# EAGLE design Joint Controller Circuit (EAGLE 7.2.0)

## Sheet 1 of 2
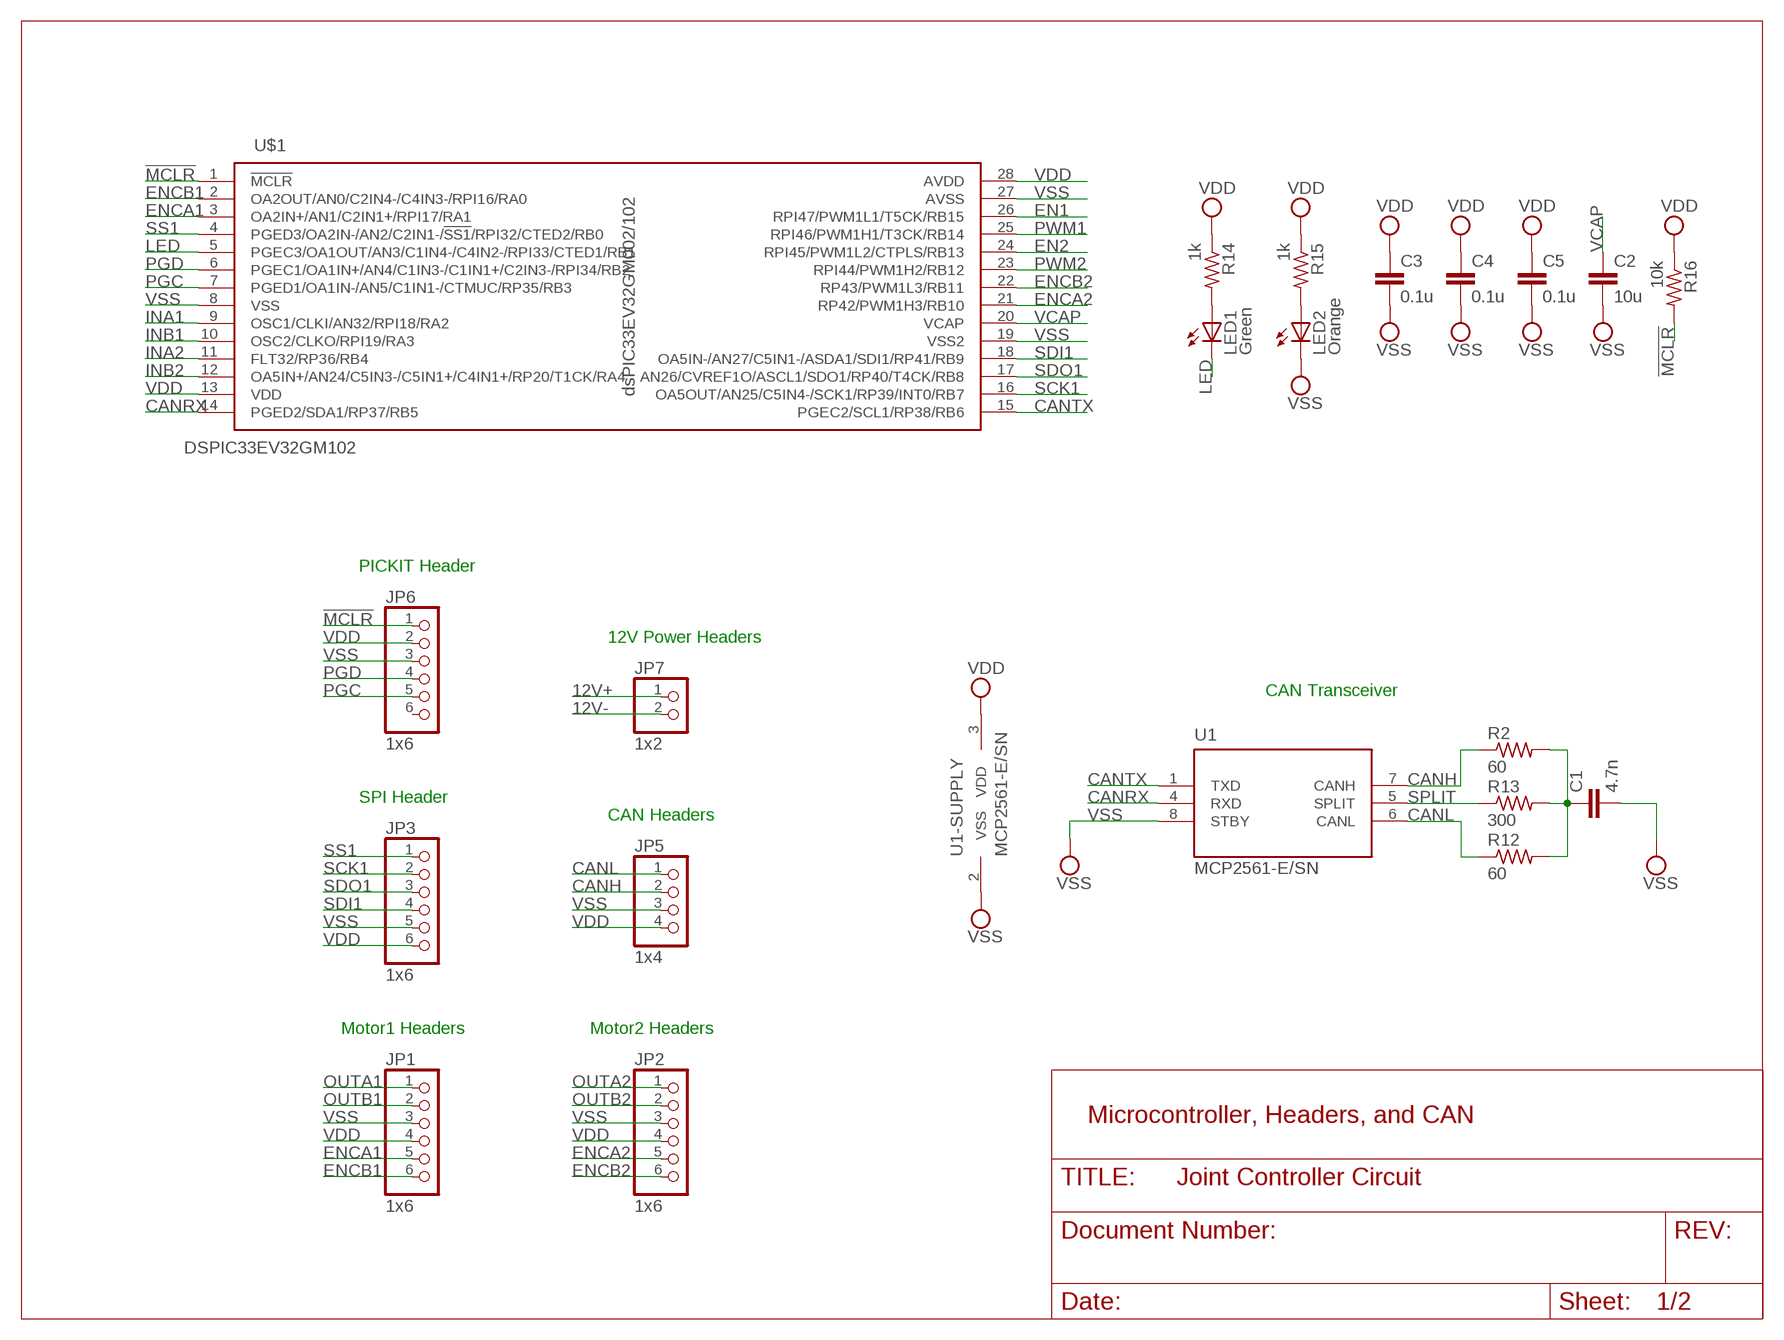
[diagram p0: schematic, sheet 1]

### Parts
C1  4.7n  C-EUC0805  [C0805]
C2  10u  C-EUC0805  [C0805]
C3  0.1u  C-EUC0805  [C0805]
C4  0.1u  C-EUC0805  [C0805]
C5  0.1u  C-EUC0805  [C0805]
JP1  1x6  PINHD-1X6  [1X06]
JP2  1x6  PINHD-1X6  [1X06]
JP3  1x6  PINHD-1X6  [1X06]
JP5  1x4  PINHD-1X4  [1X04]
JP6  1x6  PINHD-1X6  [1X06]
JP7  1x2  PINHD-1X2  [1X02]
LED1  Green  LEDCHIP-LED0805  [CHIP-LED0805]
LED2  Orange  LEDCHIP-LED0805  [CHIP-LED0805]
R2  60  R-US_R0805  [R0805]
R12  60  R-US_R0805  [R0805]
R13  300  R-US_R0805  [R0805]
R14  1k  R-US_R0805  [R0805]
R15  1k  R-US_R0805  [R0805]
R16  10k  R-US_R0805  [R0805]
U1  MCP2561-E/SN  [SOIC-8]
U$1  DSPIC33EV32GM102  [SOIC28]

### Nets
12V+: JP7.1 ; also sheet 2
12V-: JP7.2 ; also sheet 2
!MCLR: JP6.1 R16.2 U$1.1(!MCLR)
CANH: JP5.2 R2.1 U1.7(CANH)
CANL: JP5.1 R12.1 U1.6(CANL)
CANRX: U1.4(RXD) U$1.14(PGED2/SDA1/RP37/RB5)
CANTX: U1.1(TXD) U$1.15(PGEC2/SCL1/RP38/RB6)
EN1: U$1.26(RPI47/PWM1L1/T5CK/RB15) ; also sheet 2
EN2: U$1.24(RPI45/PWM1L2/CTPLS/RB13) ; also sheet 2
ENCA1: JP1.5 U$1.3(OA2IN+/AN1/C2IN1+/RPI17/RA1)
ENCA2: JP2.5 U$1.21(RP42/PWM1H3/RB10)
ENCB1: JP1.6 U$1.2(OA2OUT/AN0/C2IN4-/C4IN3-/RPI16/RA0)
ENCB2: JP2.6 U$1.22(RP43/PWM1L3/RB11)
INA1: U$1.9(OSC1/CLKI/AN32/RPI18/RA2) ; also sheet 2
INA2: U$1.11(FLT32/RP36/RB4) ; also sheet 2
INB1: U$1.10(OSC2/CLKO/RPI19/RA3) ; also sheet 2
INB2: U$1.12(OA5IN+/AN24/C5IN3-/C5IN1+/C4IN1+/RP20/T1CK/RA4) ; also sheet 2
LED: LED1.C U$1.5(PGEC3/OA1OUT/AN3/C1IN4-/C4IN2-/RPI33/CTED1/RB1)
N$3: C1.1 R2.2 R12.2 R13.2
N$4: LED1.A R14.2
N$6: LED2.A R15.2
OUTA1: JP1.1 ; also sheet 2
OUTA2: JP2.1 ; also sheet 2
OUTB1: JP1.2 ; also sheet 2
OUTB2: JP2.2 ; also sheet 2
PGC: JP6.5 U$1.7(PGED1/OA1IN-/AN5/C1IN1-/CTMUC/RP35/RB3)
PGD: JP6.4 U$1.6(PGEC1/OA1IN+/AN4/C1IN3-/C1IN1+/C2IN3-/RPI34/RB2)
PWM1: U$1.25(RPI46/PWM1H1/T3CK/RB14) ; also sheet 2
PWM2: U$1.23(RPI44/PWM1H2/RB12) ; also sheet 2
SCK1: JP3.2 U$1.16(OA5OUT/AN25/C5IN4-/SCK1/RP39/INT0/RB7)
SDI1: JP3.4 U$1.18(OA5IN-/AN27/C5IN1-/ASDA1/SDI1/RP41/RB9)
SDO1: JP3.3 U$1.17(AN26/CVREF1O/ASCL1/SDO1/RP40/T4CK/RB8)
SPLIT: R13.1 U1.5(SPLIT)
SS1: JP3.1 U$1.4(PGED3/OA2IN-/AN2/C2IN1-/!SS1!/RPI32/CTED2/RB0)
VCAP: C2.1 U$1.20(VCAP)
VDD: C3.1 C4.1 C5.1 JP1.4 JP2.4 JP3.6 JP5.4 JP6.2 R14.1 R15.1 R16.1 U1.3(VDD) U$1.13(VDD) U$1.28(AVDD) ; also sheet 2
VSS: C1.2 C2.2 C3.2 C4.2 C5.2 JP1.3 JP2.3 JP3.5 JP5.3 JP6.3 LED2.C U1.2(VSS) U1.8(STBY) U$1.8(VSS) U$1.19(VSS2) U$1.27(AVSS) ; also sheet 2
Unconnected: JP6.6

### Notes on the sheet
- PICKIT Header
- 12V Power Headers
- CAN Transceiver
- SPI Header
- CAN Headers
- Motor1 Headers | Motor2 Headers
- Microcontroller, Headers, and CAN

## Sheet 2 of 2
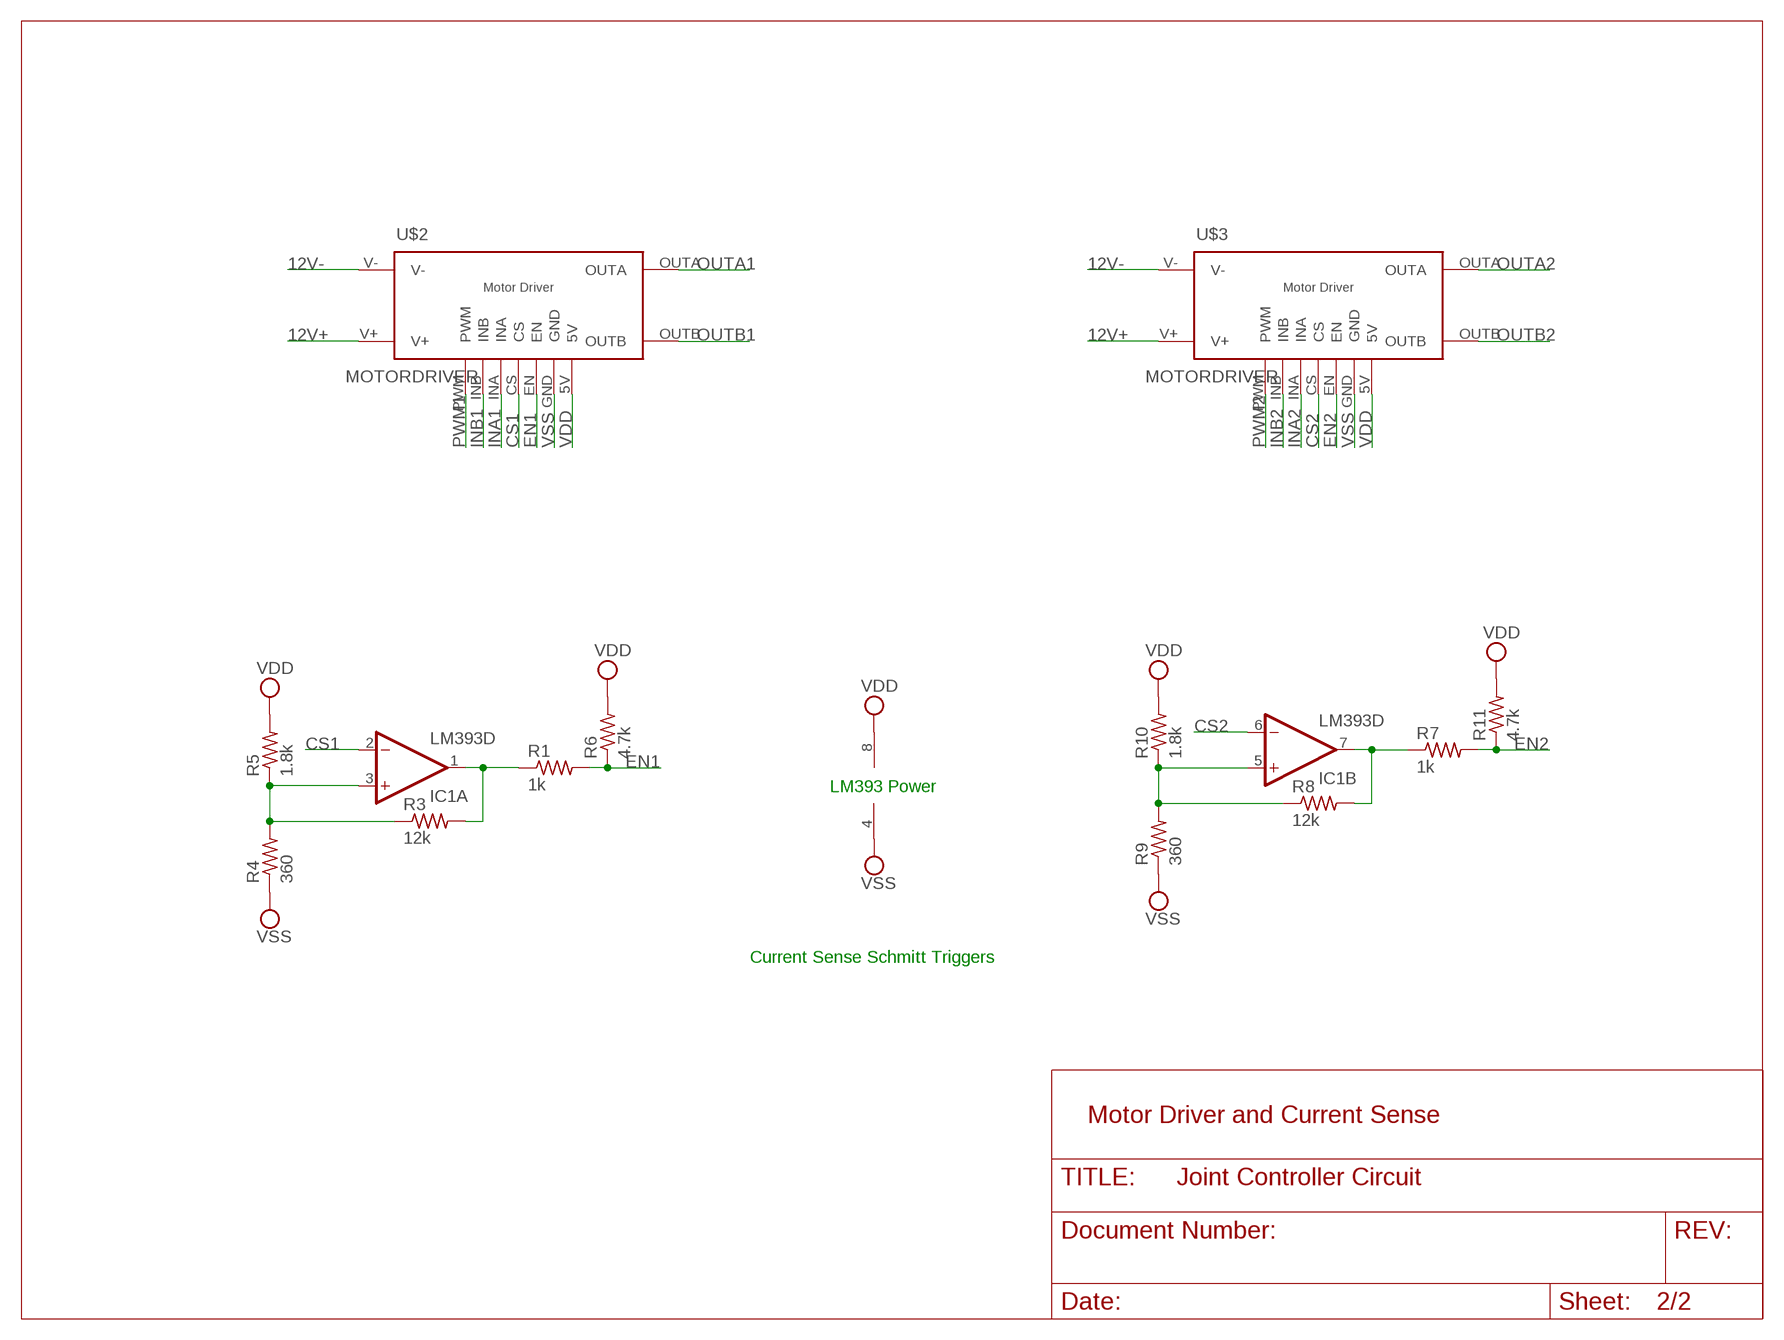
[diagram p1: schematic, sheet 2]

### Parts
IC1  LM393D  [SO08]
R1  1k  R-US_R0805  [R0805]
R3  12k  R-US_R0805  [R0805]
R4  360  R-US_R0805  [R0805]
R5  1.8k  R-US_R0805  [R0805]
R6  4.7k  R-US_R0805  [R0805]
R7  1k  R-US_R0805  [R0805]
R8  12k  R-US_R0805  [R0805]
R9  360  R-US_R0805  [R0805]
R10  1.8k  R-US_R0805  [R0805]
R11  4.7k  R-US_R0805  [R0805]
U$2  MOTORDRIVER  [MOTORDRIVER]
U$3  MOTORDRIVER  [MOTORDRIVER]

### Nets
12V+: U$2.V+ U$3.V+ ; also sheet 1
12V-: U$2.V- U$3.V- ; also sheet 1
CS1: IC1.2(A:-IN) U$2.CS
CS2: IC1.6(B:-IN) U$3.CS
EN1: R1.2 R6.1 U$2.EN ; also sheet 1
EN2: R7.2 R11.1 U$3.EN ; also sheet 1
INA1: U$2.INA ; also sheet 1
INA2: U$3.INA ; also sheet 1
INB1: U$2.INB ; also sheet 1
INB2: U$3.INB ; also sheet 1
N$2: IC1.7(B:OUT) R7.1 R8.2
N$25: IC1.5(B:+IN) R8.1 R9.2 R10.1
N$28: IC1.3(A:+IN) R3.1 R4.2 R5.1
N$30: IC1.1(A:OUT) R1.1 R3.2
OUTA1: U$2.OUTA ; also sheet 1
OUTA2: U$3.OUTA ; also sheet 1
OUTB1: U$2.OUTB ; also sheet 1
OUTB2: U$3.OUTB ; also sheet 1
PWM1: U$2.PWM ; also sheet 1
PWM2: U$3.PWM ; also sheet 1
VDD: IC1.8(P:V+) R5.2 R6.2 R10.2 R11.2 U$2.5V U$3.5V ; also sheet 1
VSS: IC1.4(P:V-) R4.1 R9.1 U$2.GND U$3.GND ; also sheet 1

### Notes on the sheet
- LM393 Power
- Current Sense Schmitt Triggers
- Motor Driver and Current Sense

## Library data of the parts
C1-C5 = rcl:C-EU: CAPACITOR, European symbol
IC1 = linear:LM393: COMPARATOR
JP1-JP3 JP6 = pinhead:PINHD-1X6: PIN HEADER
JP5 = pinhead:PINHD-1X4: PIN HEADER
JP7 = pinhead:PINHD-1X2: PIN HEADER
LED1 LED2 = led:LED: LED OSRAM: - CHIPLED LG R971, LG N971, LY N971, LG Q971, LY Q971, LO R971, LY R971 LH N974, LH R974 LS Q976, LO Q976, LY Q976 LO Q996 - Hyper CHIPLED LW Q18S LB Q993, LB Q99A, LB R99A - SideLED LS A670, LO A670, LY A670, LG A670, LP A670 LB A673, LV A673, LT A673, LW A673 LH A674 LY A675 LS A676, LA A676, LO A676, LY A676, LW A676 LS A679, LY A679, LG A679 - Hyper Micro SIDELED® LS Y876, LA Y876, LO Y876, LY Y876 LT Y87S - SmartLED LW L88C, LW L88S LB L89C, LB L89S, LG L890 LS L89K, LO L89K, LY L89K LS L896, LA L896, LO L896, LY L896 - TOPLED LS T670, LO T670, LY T670, LG T670, LP T670 LSG T670, LSP T670, LSY T670, LOP T670, LYG T670 LG T671, LOG T671, LSG T671 LB T673, LV T673, LT T673, LW T673 LH T674 LS T676, LA T676, LO T676, LY T676, LB T676, LH T676, LSB T676, LW T676 LB T67C, LV T67C, LT T67C, LS T67K, LO T67K, LY T67K, LW E67C LS E67B, LA E67B, LO E67B, LY E67B, LB E67C, LV E67C, LT E67C LW T67C LS T679, LY T679, LG T679 LS T770, LO T770, LY T770, LG T770, LP T770 LB T773, LV T773, LT T773, LW T773 LH T774 LS E675, LA E675, LY E675, LS T675 LS T776, LA T776, LO T776, LY T776, LB T776 LHGB T686 LT T68C, LB T68C - Hyper Mini TOPLED® LB M676 - Mini TOPLED Santana® LG M470 LS M47K, LO M47K, LY M47K Source: http://www.osram.convergy.de LUXEON: - LUMILED® LXK2-PW12-R00, LXK2-PW12-S00, LXK2-PW14-U00, LXK2-PW14-V00 LXK2-PM12-R00, LXK2-PM12-S00, LXK2-PM14-U00 LXK2-PE12-Q00, LXK2-PE12-R00, LXK2-PE12-S00, LXK2-PE14-T00, LXK2-PE14-U00 LXK2-PB12-K00, LXK2-PB12-L00, LXK2-PB12-M00, LXK2-PB14-N00, LXK2-PB14-P00, LXK2-PB14-Q00 LXK2-PR12-L00, LXK2-PR12-M00, LXK2-PR14-Q00, LXK2-PR14-R00 LXK2-PD12-Q00, LXK2-PD12-R00, LXK2-PD12-S00 LXK2-PH12-R00, LXK2-PH12-S00 LXK2-PL12-P00, LXK2-PL12-Q00, LXK2-PL12-R00 Source: www.luxeon.com KINGBRIGHT: KA-3528ASYC Source: www.kingbright.com
R1-R16 = rcl:R-US_: RESISTOR, American symbol
U1 = Volks73-MicrochipTechnology:MCP2561-*/?: High-Speed CAN Transceiver Documentation Datasheet <http://ww1.microchip.com/downloads/en/DeviceDoc/20005167C.pdf> General Description The MCP2561/2 is a Microchip Technology Inc. second generation high-speed CAN transceiver. It serves as an interface between a CAN protocol controller and the physical two-wire CAN bus. The device meets the automotive requirements for high-speed (up to 1 Mb/s), low quiescent current, electromagnetic compatibility (EMC) and electrostatis discharge (ESD). Features Supports 1 Mb/s Operation Implements ISO-11898-2 and ISO-11898-5 Standard Physical Layer Requirements Very Low Standby Current (5 µA, typical) VIO Supply Pin to Interface Directly to CAN Controllers and Microcontrollers with 1.8V to 5.5V I/O SPLIT Output Pin to Stabilize Common Mode in Biased Split Termination Schemes CAN Bus Pins are Disconnected when Device is Unpowered: An Unpowered Node or Brown-Out Event will Not Load the CAN Bus Detection of Ground Fault: Permanent Dominant Detection on TXD Permanent Dominant Detection on Bus Power-on Reset and Voltage Brown-Out Protection on VDD Pin Protection Against Damage Due to Short-Circuit Conditions (Positive or Negative Battery Voltage) Protection Against High-Voltage Transients in Automotive Environments Automatic Thermal Shutdown Protection Suitable for 12V and 24V Systems Meets or exceeds stringent automotive design requirements including “Hardware Requirements for LIN, CAN and FlexRay Interfaces in Automotive Applications”, Version 1.3, May 2012 High-Noise Immunity Due to Differential Bus Implementation High Electrostatic Discharge (ESD) Protection on CANH and CANL, meeting the IEC61000-4-2 up to ±14 kV Available in PDIP-8L, SOIC-8L and 3x3 DFN-8L Temperature ranges: Extended (E): -40°C to +125°C High (H): -40°C to +150°C; CATEGORY: Integrated Circuits (ICs); DATA_RATE: -; DESCRIPTION: IC TXRX CAN 8SOIC; DOCUMENTATION_LINK: <a href="http://ww1.microchip.com/downloads/en/DeviceDoc/20005167C.pdf">Datasheet</a>; DOCUMENTATION_URL: http://ww1.microchip.com/downloads/en/DeviceDoc/20005167C.pdf; DUPLEX: Full; FAMILY: Interface - Drivers, Receivers, Transceivers; MANUFACTURER: Microchip Technology; MOUNTING_TYPE: Surface Mount; NUMBER_OF_DRIVERS-RECEIVERS: 1/1; OPERATING_TEMPERATURE: -40°C ~ 125°C; PACKAGE_CASE: 8-SOIC (0.154", 3.90mm Width); PART_NUMBER: MCP2561-E/SN; PROTOCOL: CAN; RECEIVER_HYSTERSIS: -; SERIES: -; SUPPLIER_DEVICE_PACKAGE: 8-SOIC N; SUPPLIER_ITEM_INFO: http://www.digikey.com/product-detail/en/MCP2561-E%2FSN/MCP2561-E%2FSN-ND/4079961; SUPPLIER_ITEM_LINK: <a href="http://www.digikey.com/product-detail/en/MCP2561-E%2FSN/MCP2561-E%2FSN-ND/4079961">Details</a>; SUPPLIER_ITEM_NUMBER: MCP2561-E/SN-ND; SUPPLIER_ITEM_URL: http://www.digikey.com/product-detail/en/MCP2561-E%2FSN/MCP2561-E%2FSN-ND/4079961; SUPPLIER_LINK: <a href="http://www.digikey.com">Home Page</a>; SUPPLIER_NAME: Digi-Key; SUPPLIER_URL: http://www.digikey.com; TYPE: Transceiver; VOLTAGE-SUPPLY: 4.5 V ~ 5.5 V
U$1 = dsPIC33EV32GM102:DSPIC33EV32GM102
U$2 U$3 = dsPIC33EV32GM102:MOTORDRIVER

## Board
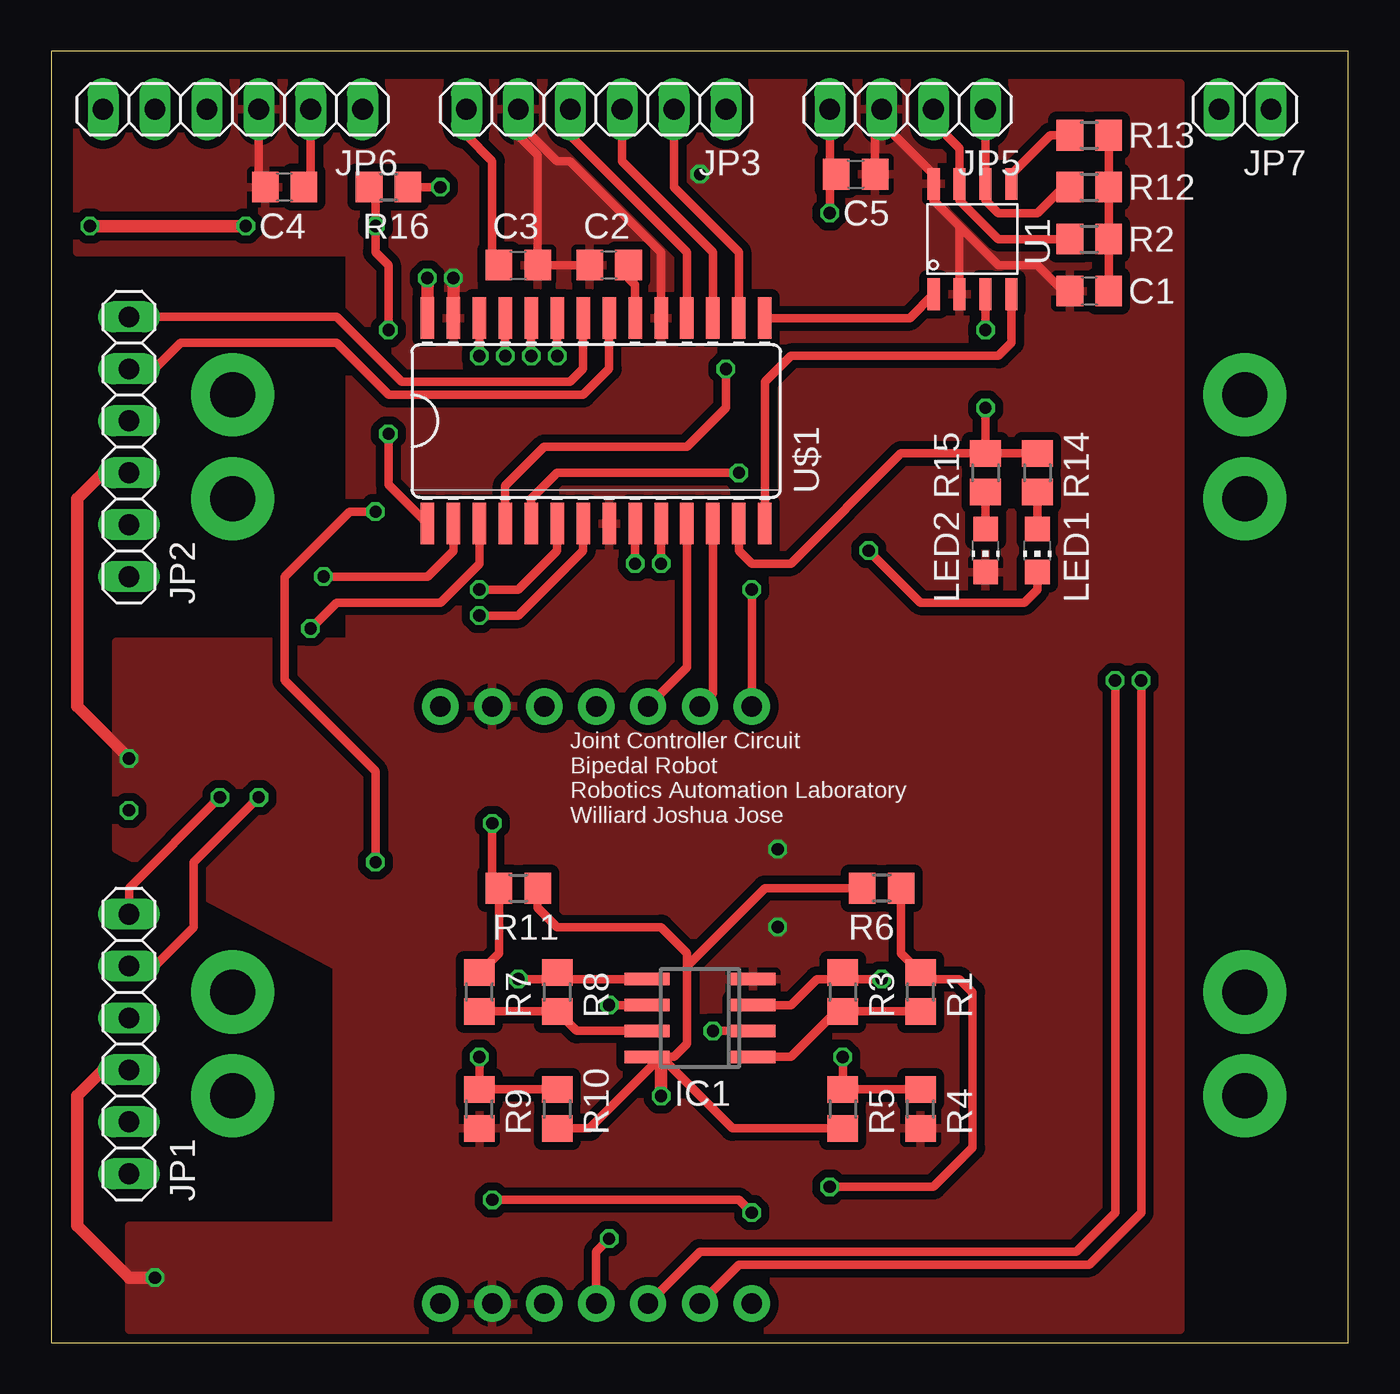
[diagram p2: board, top side]
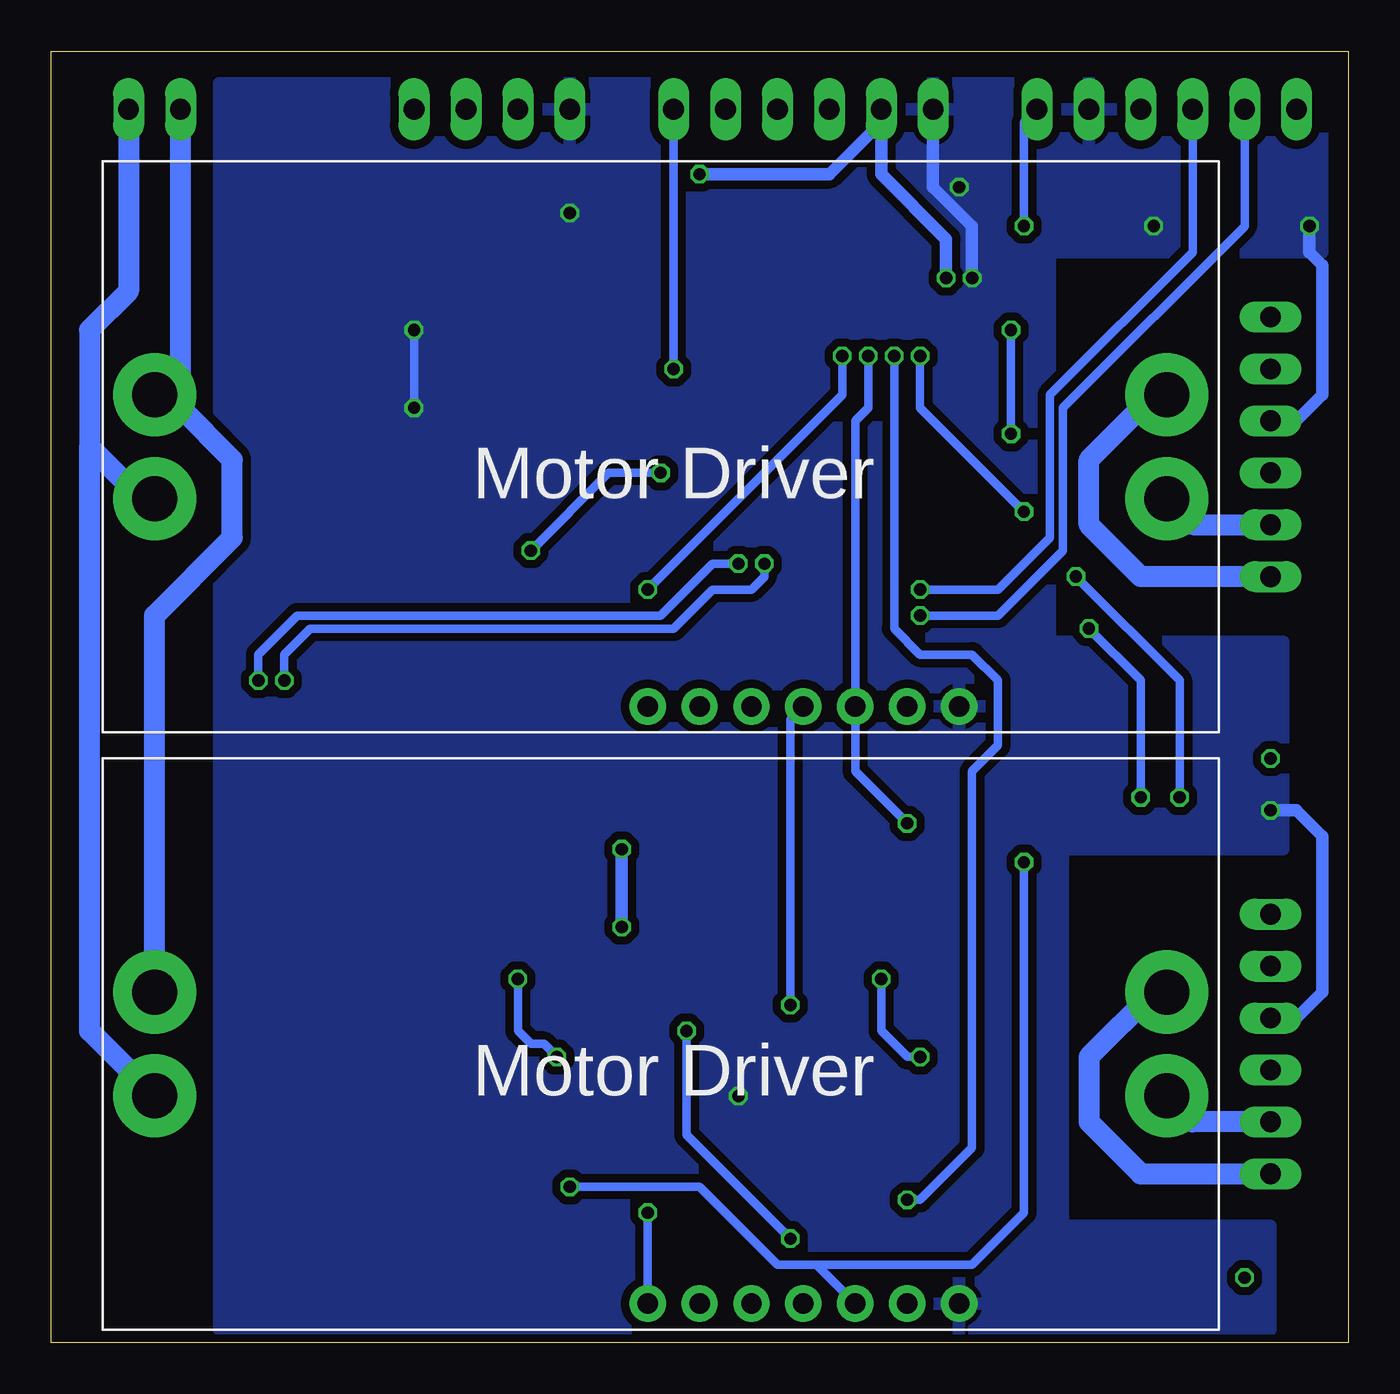
[diagram p3: board, bottom side, seen from below]

Size 63.48 x 63.17 mm. Coordinates in mm from the lower left corner, seen from the top.
Outline: 0,0 63.48,0 63.48,63.17 0,63.17 0,0
Copper layers (1*16): Top 0.035mm / dielectric 1.5mm / Bottom 0.035mm
Design rules "Elecrow_2-layer_eagle_rule": minimum track width 6mil, minimum drill 12mil, track to track 6mil, track to pad 6mil, pad to pad 6mil, via to via 6mil, smd to smd 0mil, copper to edge 10mil, drill to drill 10mil, minimum pad ring 10mil, minimum via ring 6mil, stop-mask expansion 2mil, vias tented up to drill 100mil, thermal gap 10mil

### Footprints (pad centres in the part's own frame; a part is rotated, then mirrored left to right if it is on the bottom)
C0805 = smd 1.3 x 1.5: 1 -0.95,0; 2 0.95,0
SO08 = smd 0.6 x 2.2: 1 -1.905,-2.6; 2 -0.635,-2.6; 3 0.635,-2.6; 4 1.905,-2.6; 5 1.905,2.6; 6 0.635,2.6; 7 -0.635,2.6; 8 -1.905,2.6
1X06 = drill 1.016 long: 1 -6.35,0; 2 -3.81,0; 3 -1.27,0; 4 1.27,0; 5 3.81,0; 6 6.35,0
1X04 = drill 1.016 long: 1 -3.81,0; 2 -1.27,0; 3 1.27,0; 4 3.81,0
1X02 = drill 1.016 long: 1 -1.27,0; 2 1.27,0
CHIP-LED0805 = smd 1.2 x 1.2: A 0,-1.05; C 0,1.05
R0805 = smd 1.3 x 1.5: 1 -0.95,0; 2 0.95,0
SOIC-8 = smd 1.55 x 0.6: 1 -2.7,1.905; 2 -2.7,0.635; 3 -2.7,-0.635; 4 -2.7,-1.905; 5 2.7,-1.905; 6 2.7,-0.635; 7 2.7,0.635; 8 2.7,1.905
SOIC28 = smd 0.66 x 2.032: 1 -6.985,-5.029; 2 -5.715,-5.029; 3 -4.445,-5.029; 4 -3.175,-5.029; 5 -1.905,-5.029; 6 -0.635,-5.029; 7 0.635,-5.029; 8 1.905,-5.029; 9 3.175,-5.029; 10 4.445,-5.029; 11 5.715,-5.029; 12 6.985,-5.029; 13 8.255,-5.029; 14 9.525,-5.029; 15 9.525,5.029; 16 8.255,5.029; 17 6.985,5.029; 18 5.715,5.029; 19 4.445,5.029; 20 3.175,5.029; 21 1.905,5.029; 22 0.635,5.029; 23 -0.635,5.029; 24 -1.905,5.029; 25 -3.175,5.029; 26 -4.445,5.029; 27 -5.715,5.029; 28 -6.985,5.029
MOTORDRIVER = drill 1 pad 1.778: 5V 13.97,-11.43; CS 6.35,-11.43; EN 8.89,-11.43; GND 11.43,-11.43; INA 3.81,-11.43; INB 1.27,-11.43; PWM -1.27,-11.43 | drill 2.2 pad 4.064: OUTA 24.13,3.81; OUTB 24.13,-1.27; V+ -25.4,-1.27; V- -25.4,3.81

### Placement (x,y rotation side)
C1  50.8,51.44 180 top
C2  27.3,52.7 180 top
C3  22.86,52.7 0 top
C4  11.43,56.52 180 top
C5  39.37,57.15 0 top
IC1  31.75,15.88 90 top
JP1  3.81,14.61 90 top
JP2  3.81,43.81 90 top
JP3  26.67,60.33 180 top
JP5  41.91,60.33 180 top
JP6  8.89,60.33 180 top
JP7  58.42,60.33 180 top
LED1  48.26,38.73 180 top
LED2  45.72,38.73 180 top
R1  42.55,17.14 90 top
R2  50.8,53.98 0 top
R3  38.73,17.14 270 top
R4  42.55,11.43 90 top
R5  38.73,11.43 270 top
R6  40.64,22.23 180 top
R7  20.95,17.14 90 top
R8  24.77,17.14 270 top
R9  20.95,11.43 90 top
R10  24.77,11.43 270 top
R11  22.86,22.23 0 top
R12  50.8,56.52 0 top
R13  50.8,59.05 0 top
R14  48.26,42.55 270 top
R15  45.72,42.55 270 top
R16  16.51,56.52 180 top
U1  45.09,53.98 90 top
U$1  25.4,45.09 0 top
U$2  33.02,13.34 0 bottom
U$3  33.02,42.55 0 bottom

### Tracks (layer width: path | path; a pad name or v marks a point on that pad's centre or on a via)
12V+
  Bottom 1.016: JP7.1 59.69,51.44 61.59,49.53 61.59,43.81 | 61.59,43.81 59.05,41.27 U$3.V+ | U$2.V+ 61.59,15.24 61.59,43.81
12V-
  Bottom 1.016: U$3.V- 57.15,47.62 | 57.15,47.62 JP7.2 | U$2.V- 58.42,35.56 54.61,39.37 54.61,43.18 57.15,45.72 57.15,47.62
!MCLR  (via drill 0.6)
  Top 0.406: R16.2 15.88,56.2 v15.88,54.61 15.88,53.34 16.51,52.7 v16.51,49.53 | U$1.1 16.51,41.96 v16.51,44.45
  Bottom 0.406: v16.51,44.45 v16.51,49.53 | JP6.1 15.88,59.69 v15.88,54.61
CANH
  Top 0.406: R2.1 46.35,53.98 44.45,55.88 U1.7 44.45,58.42 43.18,59.69 JP5.2
CANL
  Top 0.406: R12.1 49.53,56.52 48.26,55.24 46.35,55.24 45.72,55.88 U1.6 JP5.1
CANRX
  Top 0.406: 34.92,41.27 U$1.14 34.92,46.99 36.2,48.26 46.35,48.26 46.99,48.9 U1.4
CANTX
  Top 0.406: U$1.15 42.02,50.11 U1.1
CS1  (via drill 0.6)
  Top 0.406: IC1.2 v32.38,15.24 | v27.3,5.08 26.67,4.45 U$2.CS
  Bottom 0.406: v32.38,15.24 32.38,10.16 v27.3,5.08
CS2  (via drill 0.6)
  Top 0.406: IC1.6 v27.3,16.51
  Bottom 0.406: v27.3,16.51 27.3,30.48 U$3.CS
EN1  (via drill 0.6)
  Top 0.406: R6.1 41.59,19.05 R1.2 42.86,17.78 44.45,17.78 45.09,17.14 45.09,9.53 43.18,7.62 v38.1,7.62 | U$1.26 v20.95,48.26 | v15.88,40.64 14.61,40.64 11.43,37.47 11.43,32.38 15.88,27.94 v15.88,23.5
  Bottom 0.406: U$2.EN 26.04,3.81 | 26.04,3.81 27.94,3.81 31.75,7.62 v38.1,7.62 | v20.95,48.26 20.95,45.72 v15.88,40.64 | v15.88,23.5 15.88,6.35 18.41,3.81 22.86,3.81 23.5,3.81 26.04,3.81
EN2  (via drill 0.6)
  Top 0.406: R7.2 21.91,19.05 R11.1 21.59,22.55 v21.59,25.4 | U$1.24 v23.5,48.26
  Bottom 0.406: v21.59,25.4 24.13,27.94 U$3.EN 24.13,45.09 23.5,45.72 v23.5,48.26
ENCA1  (via drill 0.6)
  Top 0.406: JP1.5 5.08,18.41 6.99,20.32 6.99,23.5 v10.16,26.67 | U$1.3 20.95,38.1 19.05,36.2 13.97,36.2 v12.7,34.92
  Bottom 0.406: v10.16,26.67 10.16,32.38 v12.7,34.92
ENCA2
  Top 0.406: U$1.21 27.3,47.62 26.04,46.35 16.51,46.35 13.97,48.9 6.35,48.9 5.08,47.62 JP2.5
ENCB1  (via drill 0.6)
  Top 0.406: JP1.6 3.81,22.23 v8.26,26.67 | U$1.2 19.68,38.73 18.41,37.47 v13.34,37.47
  Bottom 0.406: v13.34,37.47 8.26,32.38 v8.26,26.67
ENCB2
  Top 0.406: U$1.22 26.04,47.62 25.4,46.99 17.14,46.99 13.97,50.16 JP2.6
INA1  (via drill 0.6)
  Top 0.406: U$1.9 v28.57,38.1 | U$2.INA 31.75,4.45 50.16,4.45 52.07,6.35 v52.07,32.38
  Bottom 0.406: v28.57,38.1 28.57,37.47 29.21,36.83 31.11,36.83 33.02,34.92 50.8,34.92 52.07,33.66 v52.07,32.38
INA2
  Top 0.406: U$1.11 31.11,33.02 U$3.INA
INB1  (via drill 0.6)
  Top 0.406: U$1.10 v29.84,38.1 | U$2.INB 33.66,3.81 50.8,3.81 53.34,6.35 v53.34,32.38
  Bottom 0.406: v29.84,38.1 31.11,38.1 33.66,35.56 51.44,35.56 53.34,33.66 v53.34,32.38
INB2
  Top 0.406: U$3.INB 32.38,31.75 U$1.12
LED  (via drill 0.6)
  Top 0.406: U$1.5 23.5,41.27 24.77,42.55 v33.66,42.55 | v40.01,38.73 42.55,36.2 47.62,36.2 48.26,36.83 LED1.C
  Bottom 0.406: v33.66,42.55 36.2,42.55 v40.01,38.73
N$2
  Top 0.406: IC1.7 25.72,15.24 R8.2 R7.1
N$3
  Top 0.406: R13.2 R12.2 R2.2 C1.1
N$4
  Top 0.406: R14.2 LED1.A
N$6
  Top 0.406: R15.2 LED2.A
N$25  (via drill 0.6)
  Top 0.406: IC1.5 25.08,17.78 | 25.08,17.78 R8.1 | R9.2 R10.1 21.27,12.38 20.95,12.7 v20.95,13.97 | 25.08,17.78 v22.86,17.78
  Bottom 0.406: v20.95,13.97 21.59,13.97 22.86,15.24 v22.86,17.78
N$28  (via drill 0.6)
  Top 0.406: IC1.3 36.2,16.51 37.47,17.78 38.42,17.78 | 38.42,17.78 R3.1 | R4.2 R5.1 v38.73,13.97 | 38.42,17.78 v40.64,17.78
  Bottom 0.406: v38.73,13.97 39.37,14.61 40.01,14.61 40.64,15.24 v40.64,17.78
N$30
  Top 0.406: IC1.1 36.2,13.97 38.42,16.2 R3.2 R1.1
OUTA1
  Bottom 1.016: U$2.OUTA 9.53,17.14 12.7,13.97 12.7,10.79 10.16,8.26 JP1.1
OUTA2
  Bottom 1.016: JP2.1 10.16,37.47 12.7,40.01 12.7,43.18 9.53,46.35 U$3.OUTA
OUTB1
  Bottom 1.016: JP1.2 7.62,10.79 U$2.OUTB
OUTB2
  Bottom 1.016: U$3.OUTB 7.62,40.01 JP2.2
PGC  (via drill 0.6)
  Top 0.406: v20.95,35.56 22.86,35.56 26.04,38.73 U$1.7
  Bottom 0.406: JP6.5 5.08,54.61 13.97,45.72 13.97,38.73 17.14,35.56 v20.95,35.56
PGD  (via drill 0.6)
  Top 0.406: v20.95,36.83 22.86,36.83 24.77,38.73 U$1.6
  Bottom 0.406: JP6.4 7.62,53.34 14.61,46.35 14.61,39.37 17.14,36.83 v20.95,36.83
PWM1  (via drill 0.6)
  Top 0.406: U$1.25 v22.23,48.26 | v21.59,6.99 33.66,6.99 v34.29,6.35
  Bottom 0.406: v22.23,48.26 22.23,34.92 20.95,33.66 18.41,33.66 17.14,32.38 17.14,29.21 18.41,27.94 18.41,9.53 20.95,6.99 v21.59,6.99 | v34.29,6.35 U$2.PWM
PWM2  (via drill 0.6)
  Top 0.406: U$1.23 v24.77,48.26 | v34.29,36.83 U$3.PWM
  Bottom 0.406: v24.77,48.26 24.77,46.35 v34.29,36.83
SCK1
  Top 0.406: JP3.2 30.48,56.52 33.66,53.34 U$1.16
SDI1
  Top 0.406: U$1.18 31.11,53.34 25.4,59.05 JP3.4
SDO1
  Top 0.406: U$1.17 32.38,53.34 27.94,57.78 JP3.3
SPLIT
  Top 0.406: U1.5 46.99,57.15 48.9,59.05 R13.1
SS1  (via drill 0.6)
  Top 0.406: U$1.4 22.23,41.91 24.13,43.81 31.11,43.81 33.02,45.72 v33.02,47.62
  Bottom 0.406: v33.02,47.62 JP3.1
VCAP
  Top 0.406: U$1.20 28.57,51.75 28.25,52.07 C2.1
VDD  (via drill 0.6)
  Top 0.406: U1.3 v45.72,49.53 | C3.1 21.59,53.02 21.59,57.78 20.32,59.05 JP3.6 | R11.2 23.81,21.27 24.77,20.32 29.84,20.32 31.11,19.05 31.11,18.41 | 31.11,18.41 31.11,14.61 30.48,13.97 29.84,13.97 | 29.84,13.97 IC1.8 | R5.2 33.34,10.48 29.84,13.97 | R10.2 26.36,10.48 29.84,13.97 | R6.2 34.92,22.23 31.11,18.41 | R16.1 v19.05,56.52 | JP6.2 12.7,56.84 C4.1 | C5.1 38.1,57.47 JP5.4 v38.1,55.24 | U$1.13 33.66,38.73 34.29,38.1 36.2,38.1 41.59,43.49 R15.1 | R15.1 R14.1 | R15.1 v45.72,45.72
  Top 0.61: U$1.28 v18.41,52.07 | v29.84,12.06 29.84,13.97 | v9.53,54.61 v1.91,54.61
  Bottom 0.406: v45.72,45.72 v45.72,49.53
  Bottom 0.61: v18.41,52.07 18.41,54.61 20.32,56.52 JP3.6 | v1.91,54.61 1.91,53.34 1.27,52.7 1.27,46.35 2.54,45.09 JP2.4 | v3.81,26.04 2.54,26.04 1.27,24.77 1.27,17.14 2.54,15.88 JP1.4
  pour Bottom (isolate 0.406): 1.27,61.59 55.24,61.59 55.24,0.64 3.81,0.64 3.81,5.71 13.97,5.71 13.97,24.13 3.17,24.13 3.17,34.29 14.61,34.29 14.61,53.34 1.27,53.34
VSS  (via drill 0.6)
  Top 0.406: C1.2 49.53,51.44 48.26,52.7 46.35,52.7 44.45,54.61 | U1.2 44.45,54.61 | 44.45,54.61 43.18,55.88 U1.8 43.18,57.15 40.64,59.69 | 40.64,59.69 JP5.3 | C2.2 C3.2 23.81,58.1 22.86,59.05 JP3.5 22.86,59.69 24.77,57.78 25.4,57.78 29.84,53.34 U$1.19 | JP6.3 10.16,56.84 C4.2 | C5.2 40.32,59.37 40.64,59.69
  Top 0.61: U$1.27 v19.68,52.07 | v3.81,28.57 1.27,31.11 1.27,41.27 2.54,42.55 JP2.3 | v5.08,3.17 3.81,3.17 1.27,5.71 1.27,12.06 2.54,13.34 JP1.3
  Bottom 0.61: v19.68,52.07 19.68,53.98 22.86,57.15 22.86,59.69 | 22.86,59.69 JP3.5 | v35.56,24.13 v35.56,20.32 | v31.75,57.15 25.4,57.15 22.86,59.69
  pour Top (isolate 0.406): 1.27,61.59 55.24,61.59 55.24,0.64 3.81,0.64 3.81,5.71 13.97,5.71 13.97,18.41 3.17,24.13 3.17,34.29 14.61,34.29 14.61,53.34 1.27,53.34

### Text on the board
tNames: Joint Controller Circuit / Bipedal Robot / Robotics Automation Laboratory / Williard Joshua Jose